# Altium project Veloplaco.PrjPcb
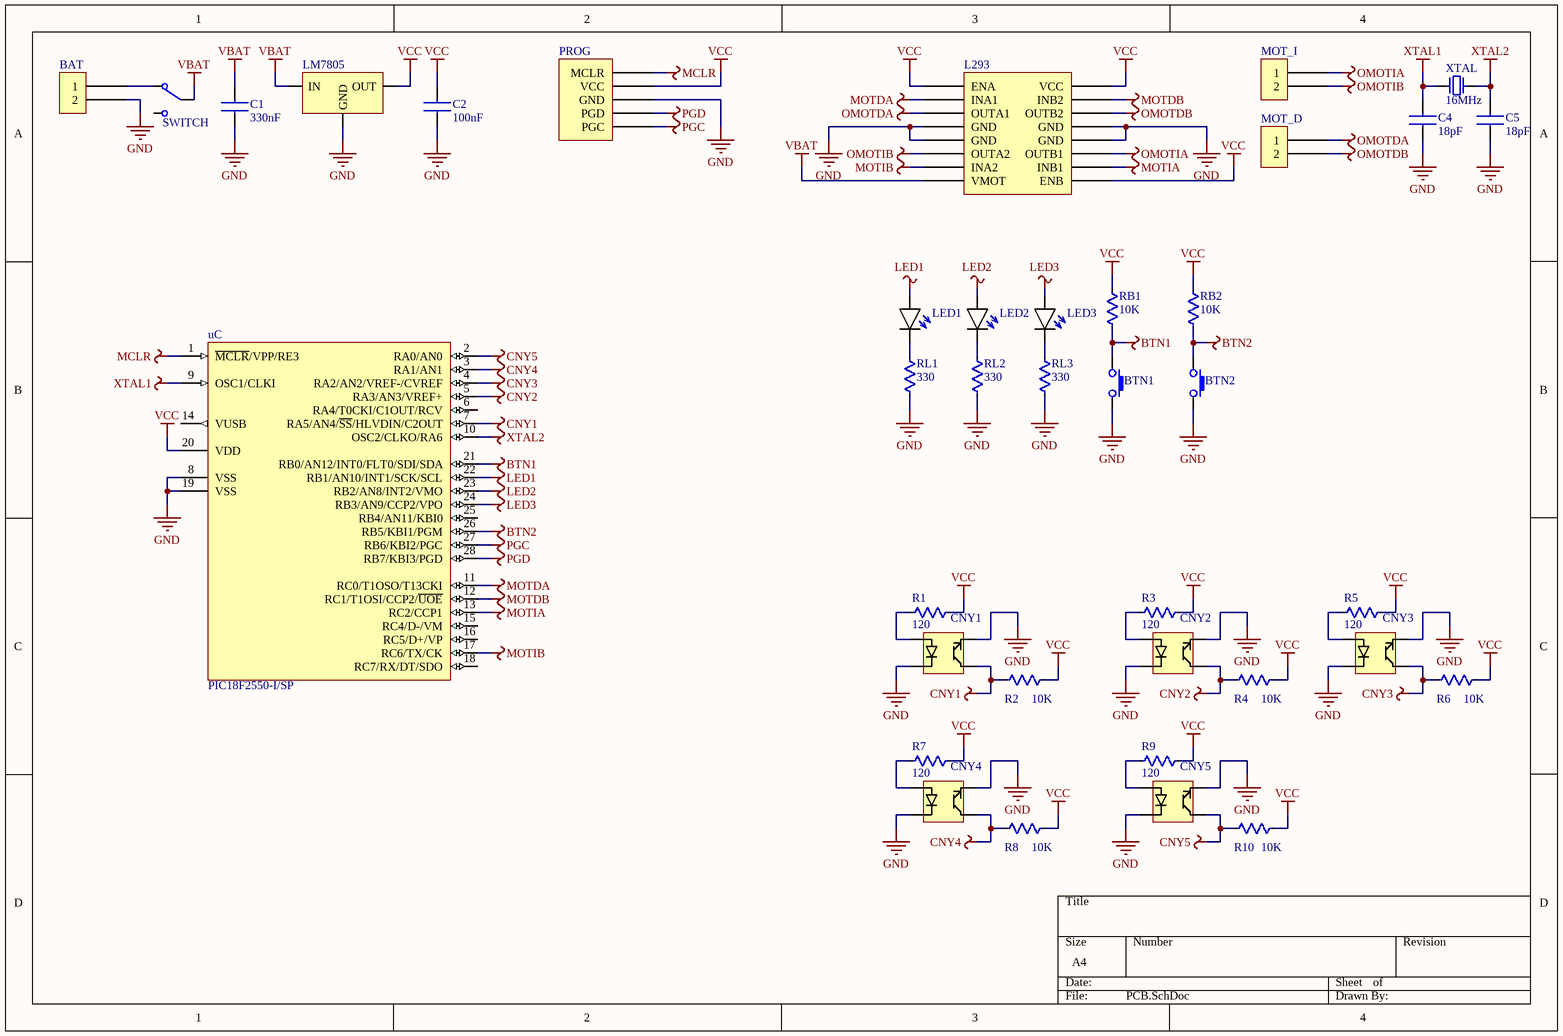
[diagram p0: PCB.SchDoc]
1 sheet, 38 parts. Net scope: global (net labels, ports and power ports of the same name join across sheets).
Board file: PCB.PcbDoc

## Sheet PCB.SchDoc
size A4

### Parts
BAT  (no value)  [HEADER 1x2]
BTN1  BUTTON_SMALL_4PIN  [TACT_SWITCH-SMALL-4PIN]  (value not drawn)
BTN2  BUTTON_SMALL_4PIN  [TACT_SWITCH-SMALL-4PIN]  (value not drawn)
C1  value 330nF  [CAP-CER]  (hidden comment: CAP-CER)
C2  value 100nF  [CAP-CER]  (hidden comment: CAP-CER)
C4  value 18pF  [CAP-CER]  (hidden comment: CAP-CER)
C5  value 18pF  [CAP-CER]  (hidden comment: CAP-CER)
CNY1  (no value)  [CNY70]
CNY2  (no value)  [CNY70]
CNY3  (no value)  [CNY70]
CNY4  (no value)  [CNY70]
CNY5  (no value)  [CNY70]
L293  L293  [DIP16]  (value not drawn)
LED1  LED  [LED-3MM-RED]  (value not drawn)
LED2  LED  [LED-3MM-YELLOW]  (value not drawn)
LED3  LED  [LED-3MM-GREEN]  (value not drawn)
LM7805  LM78XX  [TO-220-STRAIGHT]  (value not drawn)
MOT_D  (no value)  [HEADER 1x2]
MOT_I  (no value)  [HEADER 1x2]
PROG  (no value)  [Header 1x5]
R1  value 120  [RES-Axial-400mil]  (hidden comment: RES)
R2  value 10K  [RES-Axial-400mil]  (hidden comment: RES)
R3  value 120  [RES-Axial-400mil]  (hidden comment: RES)
R4  value 10K  [RES-Axial-400mil]  (hidden comment: RES)
R5  value 120  [RES-Axial-400mil]  (hidden comment: RES)
R6  value 10K  [RES-Axial-400mil]  (hidden comment: RES)
R7  value 120  [RES-Axial-400mil]  (hidden comment: RES)
R8  value 10K  [RES-Axial-400mil]  (hidden comment: RES)
R9  value 120  [RES-Axial-400mil]  (hidden comment: RES)
R10  value 10K  [RES-Axial-400mil]  (hidden comment: RES)
RB1  value 10K  [RES-Axial-400mil]  (hidden comment: RES)
RB2  value 10K  [RES-Axial-400mil]  (hidden comment: RES)
RL1  value 330  [RES-Axial-400mil]  (hidden comment: RES)
RL2  value 330  [RES-Axial-400mil]  (hidden comment: RES)
RL3  value 330  [RES-Axial-400mil]  (hidden comment: RES)
SWITCH  SLIDE-SWITCH  [SWITCH]  (value not drawn)
uC  PIC18F2550-I/SP  [DIP28]
XTAL  FREQUENCY: 16MHz  [CRYSTAL-TH]  (hidden comment: XTAL)

### Nets
BTN1: BTN1.1 RB1.2 uC.21(RB0/AN12/INT0/FLT0/SDI/SDA)
BTN2: BTN2.1 RB2.2 uC.26(RB5/KBI1/PGM)
CNY1: CNY1.C R2.1 uC.7(RA5/AN4/~{SS}/HLVDIN/C2OUT)
CNY2: CNY2.C R4.1 uC.5(RA3/AN3/VREF+)
CNY3: CNY3.C R6.1 uC.4(RA2/AN2/VREF-/CVREF)
CNY4: CNY4.C R8.1 uC.3(RA1/AN1)
CNY5: CNY5.C R10.1 uC.2(RA0/AN0)
GND: BAT.2 BTN1.2 BTN2.2 C1.2 C2.2 C4.1 C5.1 CNY1.E(7.5) CNY1.K CNY2.E(7.5) CNY2.K CNY3.E(7.5) CNY3.K CNY4.E(7.5) CNY4.K CNY5.E(7.5) CNY5.K L293.4(GND) L293.5(GND) L293.12(GND) L293.13(GND) LM7805.2(GND) PROG.3(GND) RL1.1 RL2.1 RL3.1 uC.8(VSS) uC.19(VSS)
LED1: LED1.A uC.22(RB1/AN10/INT1/SCK/SCL)
LED2: LED2.A uC.23(RB2/AN8/INT2/VMO)
LED3: LED3.A uC.24(RB3/AN9/CCP2/VPO)
MCLR: PROG.1(MCLR) uC.1(~{MCLR}/VPP/RE3)
MOTDA: L293.2(INA1) uC.11(RC0/T1OSO/T13CKI)
MOTDB: L293.15(INB2) uC.12(RC1/T1OSI/CCP2/~{UOE})
MOTIA: L293.10(INB1) uC.13(RC2/CCP1)
MOTIB: L293.7(INA2) uC.17(RC6/TX/CK)
OMOTDA: L293.3(OUTA1) MOT_D.1
OMOTDB: L293.14(OUTB2) MOT_D.2
OMOTIA: L293.11(OUTB1) MOT_I.1
OMOTIB: L293.6(OUTA2) MOT_I.2
PGC: PROG.5(PGC) uC.27(RB6/KBI2/PGC)
PGD: PROG.4(PGD) uC.28(RB7/KBI3/PGD)
VBAT: C1.1 L293.8(VMOT) LM7805.1(IN) SWITCH.2
VCC: C2.1 L293.1(ENA) L293.9(ENB) L293.16(VCC) LM7805.3(OUT) PROG.2(VCC) R1.2 R2.2 R3.2 R4.2 R5.2 R6.2 R7.2 R8.2 R9.2 R10.2 RB1.1 RB2.1 uC.20(VDD)
XTAL1: C4.2 uC.9(OSC1/CLKI) XTAL.1
XTAL2: C5.2 uC.10(OSC2/CLKO/RA6) XTAL.2
NetBAT_1: BAT.1 SWITCH.1
NetCNY1_A: CNY1.A R1.1
NetCNY2_A: CNY2.A R3.1
NetCNY3_A: CNY3.A R5.1
NetCNY4_A: CNY4.A R7.1
NetCNY5_A: CNY5.A R9.1
NetLED1_K: LED1.K RL1.2
NetLED2_K: LED2.K RL2.2
NetLED3_K: LED3.K RL3.2

Not connected (* = marked no-connect by the designer): SWITCH 3; uC 6(RA4/T0CKI/C1OUT/RCV) 14(VUSB) 15(RC4/D-/VM) 16(RC5/D+/VP) 18(RC7/RX/DT/SDO) 25(RB4/AN11/KBI0)

### Library data of the parts
BAT MOT_D MOT_I = Header 1x2
C4 C5 = CAPc
CNY1-CNY5 = CNY70
PROG = Header Programmer
uC = PIC18F2550-I/SP: High Performance, Enhanced Flash, USB Microcontroller with nanoWatt Technology, 32K Flash, 28-Pin SPDIP, Industrial Temperature Range; Published: 29-Jan-2009; LatestRevisionDate: 02-Dec-2009; LatestRevisionNote: Updated to datasheet revision E, Aug-2008; DatasheetVersion: revE, Aug-2008; PackageVersion: revBB, Aug-2009; PackageReference: SPDIP300-SP28; Publisher: Altium Limited; PackageDescription: 28-Lead Skinny Plastic Dual In-Line (SP) - 300 mil Body [SPDIP]; Supplier 1: Digi-Key; Supplier Part Number 1: PIC18F2550-I/SP-ND; Supplier 2: Farnell; Supplier Part Number 2: 9321250; Supplier 3: Farnell; Supplier Part Number 3: 1523822; ComponentLink1Description: Datasheet; ComponentLink1URL: http://ww1.microchip.com/downloads/en/DeviceDoc/39632e.pdf; ComponentLink2Description: Packaging Specification; ComponentLink2URL: http://www.microchip.com/stellent/groups/techpub_sg/documents/packagingspec/en012702.pdf; ComponentLink3Description: Microchip.com Home; ComponentLink3URL: http://www.microchip.com/